# Altium project wifi_can.PrjPcb
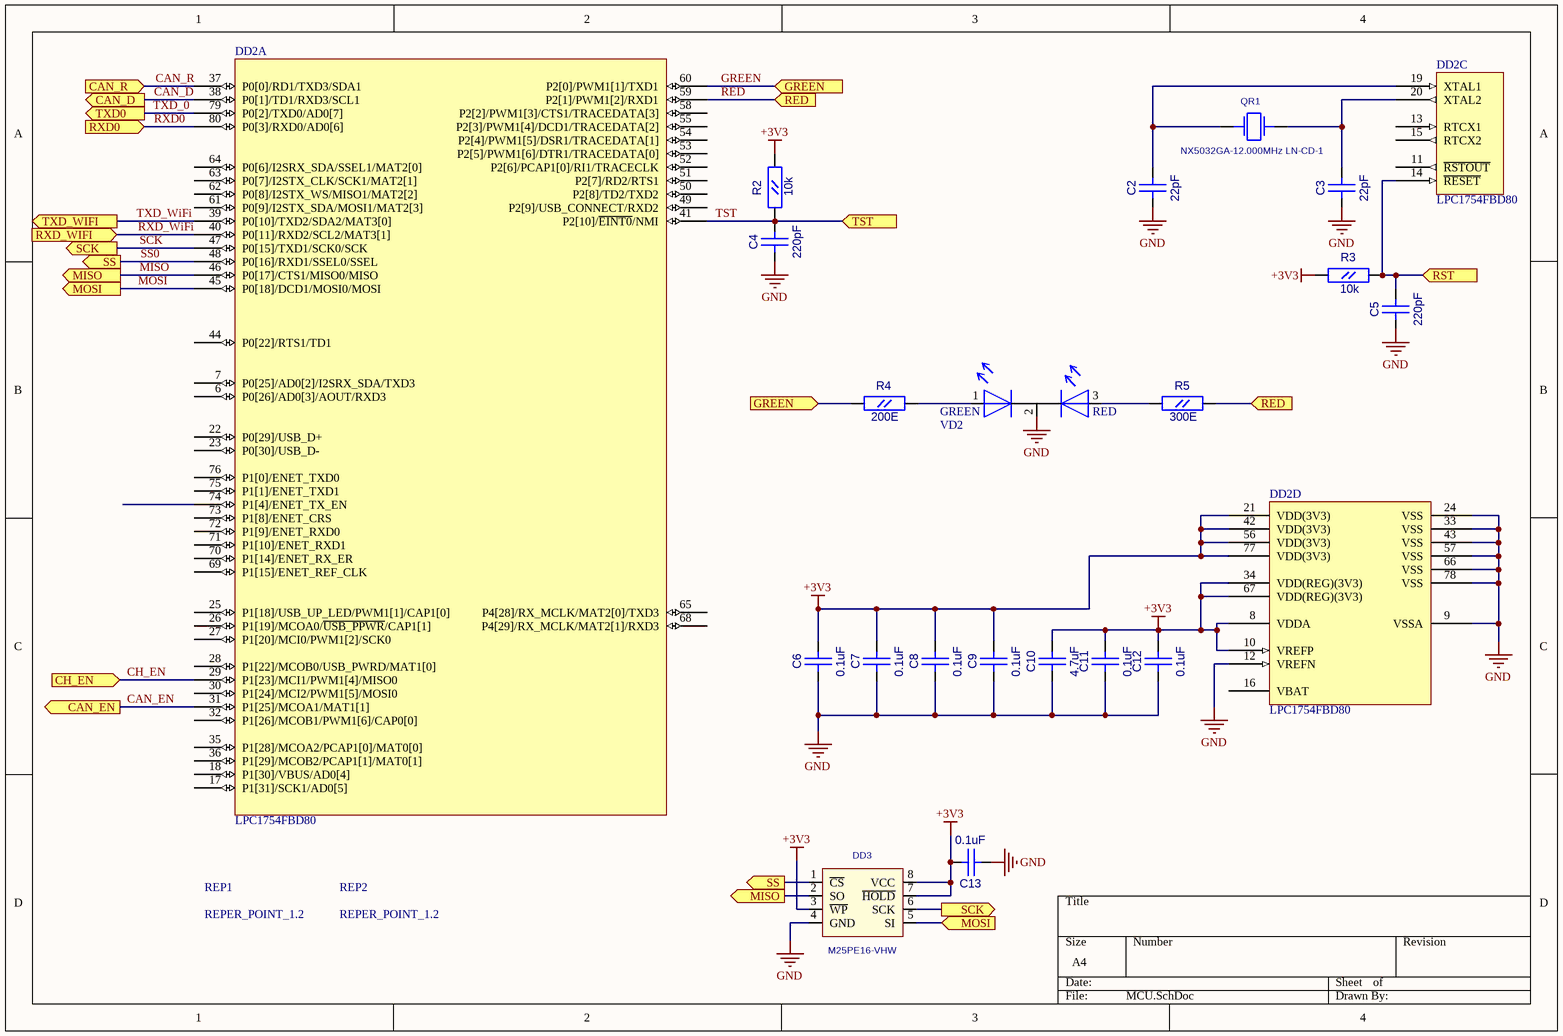
[diagram p0: MCU.SchDoc]
5 sheets, 64 parts. Net scope: flat (ports and power ports of the same name join across sheets).
Board file: wifi_can.PcbDoc
Sheets:
  MCU.SchDoc
  Power.SchDoc
  WiFi.SchDoc
  CAN.SchDoc
  Connections.SchDoc

## Sheet MCU.SchDoc
size A4

### Parts
C2  22pF  [CC0603]
C3  22pF  [CC0603]
C4  220pF  [CC0603]
C5  220pF  [CC0603]
C6  0.1uF  [CC0603]
C7  0.1uF  [CC0603]
C8  0.1uF  [CC0603]
C9  0.1uF  [CC0603]
C10  4.7uF  [CC0805]
C11  0.1uF  [CC0603]
C12  0.1uF  [CC0603]
C13  0.1uF  [CC0603]
DD2  LPC1754FBD80  [TQFP-80_0.5]  (parts A,C,D of 4)
DD3  M25PE16-VHW  [EIAJ_SO8]
QR1  NX5032GA-12.000MHz LN-CD-1  [AC5032_2]
R2  10k  [RC0603]
R3  10k  [RC0603]
R4  200E  [RC0603]
R5  300E  [RC0603]
REP1  REPER_POINT_1.2  [REPER1.2]
REP2  REPER_POINT_1.2  [REPER1.2]
VD2  GNL3015UEUGW  [GNL3015]  (value not drawn)

### Ports
CAN_D (out), CAN_EN (out), CAN_R (in), CH_EN (in), GREEN (in), MISO (out), MOSI (in), MOSI (out), RED (in), RST (in), RXD0 (in), RXD_WIFI (in), SCK (out), SS (out), TST (in), TXD0 (out), TXD_WIFI (out)

### Nets
+3V3: C6.2(B) C7.2(B) C8.2(B) C9.2(B) C10.2(B) C11.2(B) C12.2(B) C13.2(B) DD2.8(VDDA) DD2.10(VREFP) DD2.21(VDD(3V3)) DD2.34(VDD(REG)(3V3)) DD2.42(VDD(3V3)) DD2.56(VDD(3V3)) DD2.67(VDD(REG)(3V3)) DD2.77(VDD(3V3)) DD3.3(~{WP}) DD3.7(~{HOLD}) DD3.8(VCC) R2.2(B) R3.1(A)
GND: C2.1(A) C3.1(A) C4.1(A) C5.1(A) C6.1(A) C7.1(A) C8.1(A) C9.1(A) C10.1(A) C11.1(A) C12.1(A) C13.1(A) DD2.9(VSSA) DD2.12(VREFN) DD2.24(VSS) DD2.33(VSS) DD2.43(VSS) DD2.57(VSS) DD2.66(VSS) DD2.78(VSS) DD3.4(GND) VD2.2
CAN_D: DD2.38(P0[1]/TD1/RXD3/SCL1) ; port CAN_D
CAN_EN: DD2.31(P1[25]/MCOA1/MAT1[1]) ; port CAN_EN
CAN_R: DD2.37(P0[0]/RD1/TXD3/SDA1) ; port CAN_R
CH_EN: DD2.29(P1[23]/MCI1/PWM1[4]/MISO0) ; port CH_EN
GREEN: DD2.60(P2[0]/PWM1[1]/TXD1) R4.1(A) ; port GREEN
MISO: DD2.46(P0[17]/CTS1/MISO0/MISO) DD3.2(SO) ; port MISO
MOSI: DD2.45(P0[18]/DCD1/MOSI0/MOSI) DD3.5(SI) ; port MOSI
RED: DD2.59(P2[1]/PWM1[2]/RXD1) R5.2(B) ; port RED
RXD0: DD2.80(P0[3]/RXD0/AD0[6]) ; port RXD0
RXD_WiFi: DD2.40(P0[11]/RXD2/SCL2/MAT3[1]) ; port RXD_WIFI
SCK: DD2.47(P0[15]/TXD1/SCK0/SCK) DD3.6(SCK) ; port SCK
SS0: DD2.48(P0[16]/RXD1/SSEL0/SSEL) DD3.1(~{CS}) ; port SS
TST: C4.2(B) DD2.41(P2[10]/~{EINT0}/NMI) R2.1(A) ; port TST
TXD_0: DD2.79(P0[2]/TXD0/AD0[7]) ; port TXD0
TXD_WiFi: DD2.39(P0[10]/TXD2/SDA2/MAT3[0]) ; port TXD_WIFI
NetC2_2: C2.2(B) DD2.19(XTAL1) QR1.1
NetC3_2: C3.2(B) DD2.20(XTAL2) QR1.2
NetC5_2: C5.2(B) DD2.14(~{RESET}) R3.2(B) ; port RST
NetR4_2: R4.2(B) VD2.1(G)
NetR5_1: R5.1(A) VD2.3

Not connected (* = marked no-connect by the designer): DD2 6(P0[26]/AD0[3]/AOUT/RXD3) 7(P0[25]/AD0[2]/I2SRX_SDA/TXD3) 11(~{RSTOUT}) 13(RTCX1) 15(RTCX2) 16(VBAT) 17(P1[31]/SCK1/AD0[5]) 18(P1[30]/VBUS/AD0[4]) 22(P0[29]/USB_D+) 23(P0[30]/USB_D-) 25(P1[18]/USB_UP_LED/PWM1[1]/CAP1[0]) 26(P1[19]/MCOA0/~{USB_PPWR}/CAP1[1]) 27(P1[20]/MCI0/PWM1[2]/SCK0) 28(P1[22]/MCOB0/USB_PWRD/MAT1[0]) 30(P1[24]/MCI2/PWM1[5]/MOSI0) 32(P1[26]/MCOB1/PWM1[6]/CAP0[0]) 35(P1[28]/MCOA2/PCAP1[0]/MAT0[0]) 36(P1[29]/MCOB2/PCAP1[1]/MAT0[1]) 44(P0[22]/RTS1/TD1) 49(P2[9]/USB_CONNECT/RXD2) 50(P2[8]/TD2/TXD2) 51(P2[7]/RD2/RTS1) 52(P2[6]/PCAP1[0]/RI1/TRACECLK) 53(P2[5]/PWM1[6]/DTR1/TRACEDATA[0]) 54(P2[4]/PWM1[5]/DSR1/TRACEDATA[1]) 55(P2[3]/PWM1[4]/DCD1/TRACEDATA[2]) 58(P2[2]/PWM1[3]/CTS1/TRACEDATA[3]) 61(P0[9]/I2STX_SDA/MOSI1/MAT2[3]) 62(P0[8]/I2STX_WS/MISO1/MAT2[2]) 63(P0[7]/I2STX_CLK/SCK1/MAT2[1]) 64(P0[6]/I2SRX_SDA/SSEL1/MAT2[0]) 65(P4[28]/RX_MCLK/MAT2[0]/TXD3) 68(P4[29]/RX_MCLK/MAT2[1]/RXD3) 69(P1[15]/ENET_REF_CLK) 70(P1[14]/ENET_RX_ER) 71(P1[10]/ENET_RXD1) 72(P1[9]/ENET_RXD0) 73(P1[8]/ENET_CRS) 74(P1[4]/ENET_TX_EN) 75(P1[1]/ENET_TXD1) 76(P1[0]/ENET_TXD0); REP1 1; REP2 1

### Notes on the sheet
- (in symbol GNL3015-UEUGW) GREEN; RED

### Library data of the parts
C2-C9 C11-C13 = CC0603
  C2 C3: Value: 22pF
  C4 C5: Value: 220pF
  C6-C9 C11-C13: Value: 0.1uF
C10 = CC0805: Value: 4.7uF
DD2 = LPC1754FBD80: Cortex -M3 32-Bit Microcontroller, 128KB Flash, 64KB RAM, 800-Lead LQFP; ComponentLink1Description: Manufacturer Link; ComponentLink1URL: http://www.nxp.com/
DD3 = S25FL016A0LMFI01: Value: M25PE16-VHW
QR1 = AC5032_2: AC5032/2; Value: NX5032GA-12.000MHz LN-CD-1
R2-R5 = RC0603
  R2 R3: Value: 10k
  R4: Value: 200E
  R5: Value: 300E
REP1 REP2 = REPER1.2: Value: REPER_POINT_1.2
VD2 = GNL3015-UEUGW: Value: GNL3015UEUGW

## Sheet Power.SchDoc
size A4
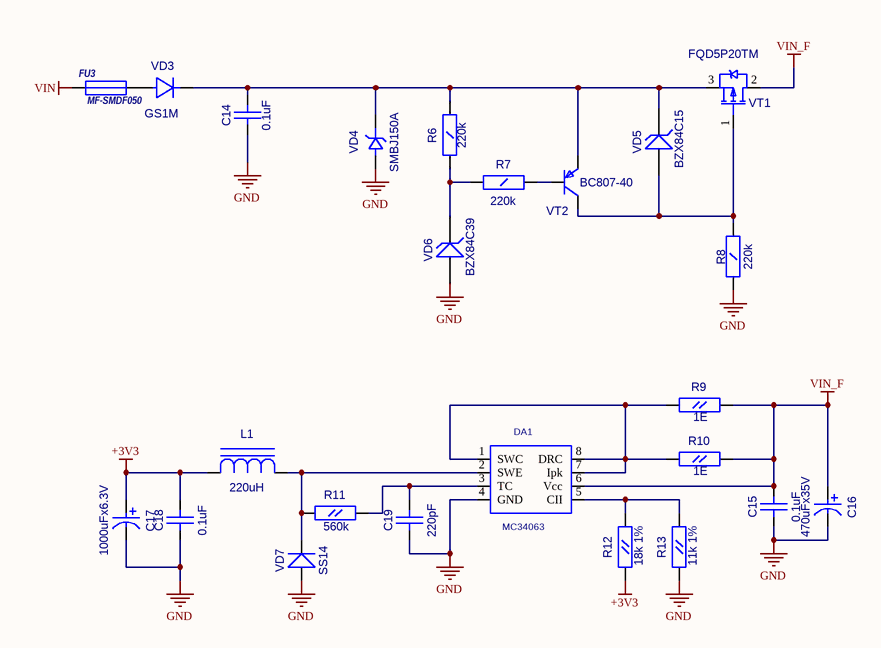
[diagram p1: Power.SchDoc]

### Parts
C14  0.1uF  [CC1206]
C15  0.1uF  [CC0603]
C16  470uFx35V  [CC16X10_CAP0.5(1)(Primary)]
C17  1000uFx6.3V  [CC8X3.5]
C18  0.1uF  [CC0603]
C19  220pF  [CC0603]
DA1  MC34063  [SO-8]
FU3  MF-SMDF050  [MF-SMDF]
L1  220uH  [SDR0805]
R6  220k  [RC1206]
R7  220k  [RC1206]
R8  220k  [RC1206]
R9  1E  [RC0805]
R10  1E  [RC0805]
R11  560k  [RC0603]
R12  18k 1%  [RC0603]
R13  11k 1%  [RC0603]
VD3  GS1M  [SMA]
VD4  SMBJ150A  [SMB]
VD5  BZX84C15  [SOT-23(123)]
VD6  BZX84C39  [SOT-23(123)]
VD7  SS14  [SMA]
VT1  FQD5P20TM  [D-PAK(TO-252AA)]
VT2  BC807-40  [SOT-23(123)]

### Nets
+3V3: C17.1 C18.2(B) L1.1(C) R12.1(A)
GND: C14.1(A) C15.1(A) C16.1 C17.2 C18.1(A) C19.1(A) DA1.4(GND) R8.2(B) R13.1(A) VD4.1(A) VD6.1(A) VD7.1(A)
VIN: FU3.1
VIN_F: C15.2(B) C16.2 DA1.6(Vcc) R9.2(B) R10.2(B) VT1.2(D)
NetC14_2: C14.2(B) R6.2(B) VD3.2(K) VD4.2(K) VD5.3(K) VT1.3(S) VT2.2(E)
NetC19_2: C19.2(B) DA1.3(TC) R11.2(B)
NetDA1_1: DA1.1(SWC) DA1.7(Ipk) DA1.8(DRC) R9.1(A) R10.1(A)
NetDA1_2: DA1.2(SWE) L1.2(A) R11.1(A) VD7.2(K)
NetDA1_5: DA1.5(CII) R12.2(B) R13.2(B)
NetFU3_2: FU3.2 VD3.1(A)
NetR6_1: R6.1(A) R7.1(A) VD6.3(K)
NetR7_2: R7.2(B) VT2.1(B)
NetR8_1: R8.1(A) VD5.1(A) VT1.1(G) VT2.3(C)

### Library data of the parts
C14 = CC1206: Value: 0.1uF
C15 C18 C19 = CC0603
  C15 C18: Value: 0.1uF
  C19: Value: 220pF
C16 = CAP0.5(1): Value: 470uFx35V
C17 = CAP0.35: Value: 1000uFx6.3V
FU3 = MF-SMDF: Value: MF-SMDF050
L1 = SDR0805: Value: 220uH
R6-R8 = RC1206: Value: 220k
R9 R10 = RC0805: Value: 1E
R11-R13 = RC0603
  R11: Value: 560k
  R12: Value: 18k 1%
  R13: Value: 11k 1%
VD3 = GS1M: Value: {Value}
VD4 = SMBJ: Value: SMBJ150A
VD5 VD6 = BZX84: Zener Voltage Regulator Diode; Value: {Value}
VD7 = SS14: Schottky Rectifier; OriginalName: 10BQ100; ComponentField6: Published 8-Jun-2000, Modified 10-July-2000: SIM Model Added.; Value: SS14
VT1 = IRFR9220: HEXFET Power MOSFET; OriginalName: IRLML5103; ComponentField7: Published 8-Jun-2000; Value: FQD5P20TM
VT2 = BC857B: OriginalName: BC846BLT1; ComponentField7: Published 29-Sep-2000; Value: BC807-40
DA1 = MC34063: Value: *

## Sheet WiFi.SchDoc
size A4
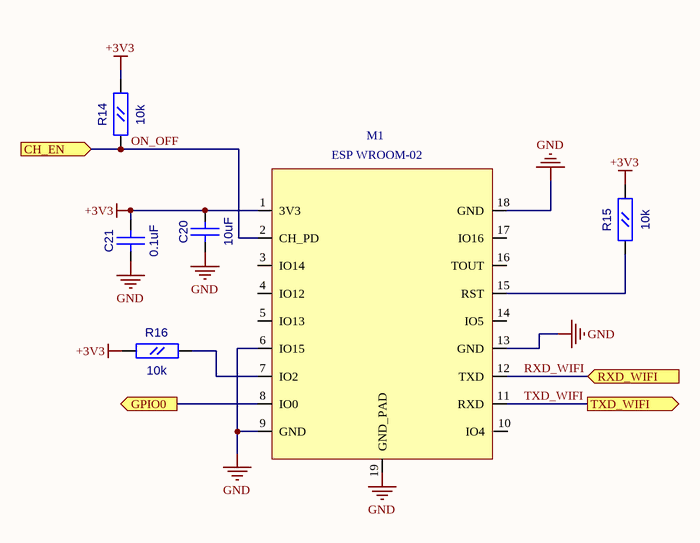
[diagram p2: WiFi.SchDoc]

### Parts
C20  10uF  [CC0805]
C21  0.1uF  [CC0603]
M1  ESP WROOM-02  [ESP-WOORM-02]
R14  10k  [RC0603]
R15  10k  [RC0603]
R16  10k  [RC0603]

### Ports
CH_EN (in), GPIO0 (out), RXD_WIFI (in), TXD_WIFI (out)

### Nets
+3V3: C20.2(B) C21.2(B) M1.1(3V3) R14.2(B) R15.2(B) R16.1(A)
GND: C20.1(A) C21.1(A) M1.6(IO15) M1.9(GND) M1.13(GND) M1.18(GND) M1.19(GND_PAD)
ON_OFF: M1.2(CH_PD) R14.1(A) ; port CH_EN  [project net CH_EN]
RXD_WiFi: M1.12(TXD) ; port RXD_WIFI
TXD_WiFi: M1.11(RXD) ; port TXD_WIFI
NetM1_7: M1.7(IO2) R16.2(B)
NetM1_8: M1.8(IO0) ; port GPIO0
NetM1_15: M1.15(RST) R15.1(A)

Not connected (* = marked no-connect by the designer): M1 3(IO14) 4(IO12) 5(IO13) 10(IO4) 14(IO5) 16(TOUT) 17(IO16)

### Library data of the parts
C20 = CC0805: Value: 10uF
C21 = CC0603: Value: 0.1uF
M1 = ESP-WROOM-02: Value: ESP WROOM-02
R14-R16 = RC0603: Value: 10k

## Sheet CAN.SchDoc
size A4
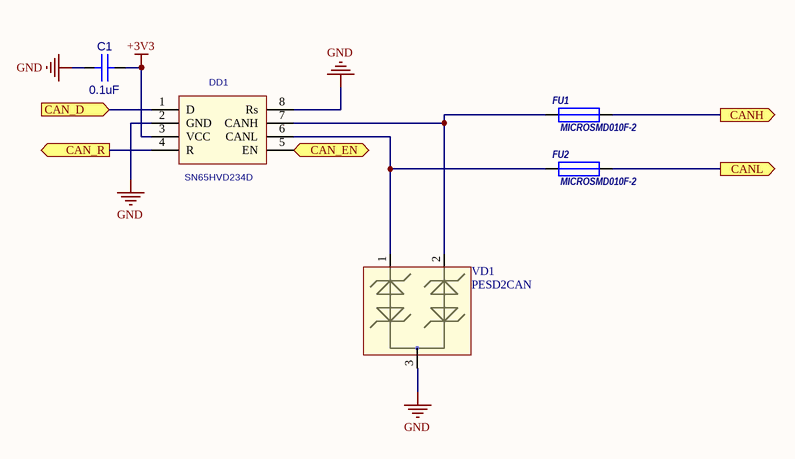
[diagram p3: CAN.SchDoc]

### Parts
C1  0.1uF  [CC0603]
DD1  SN65HVD234D  [SO-8]
FU1  MICROSMD010F-2  [RC1210]
FU2  MICROSMD010F-2  [RC1210]
VD1  PESD2CAN  [SOT-23(123)]

### Ports
CAN_D (in), CAN_EN (out), CAN_R (out), CANH (out), CANL (out)

### Nets
+3V3: C1.2(B) DD1.3(VCC)
GND: C1.1(A) DD1.2(GND) DD1.8(Rs) VD1.3
CAN_D: DD1.1(D) ; port CAN_D
CAN_EN: DD1.5(EN) ; port CAN_EN
CAN_R: DD1.4(R) ; port CAN_R
NetDD1_6: DD1.6(CANL) FU2.1 VD1.1
NetDD1_7: DD1.7(CANH) FU1.1 VD1.2
NetFU1_2: FU1.2 ; port CANH
NetFU2_2: FU2.2 ; port CANL

### Library data of the parts
C1 = CC0603: Value: 0.1uF
DD1 = SN65HVD234D: CAN Transceiver; Value: *
FU1 FU2 = MICROSMD: Value: MICROSMD010F-2
VD1 = PESD2CAN: TVS for CAN

## Sheet Connections.SchDoc
size A4
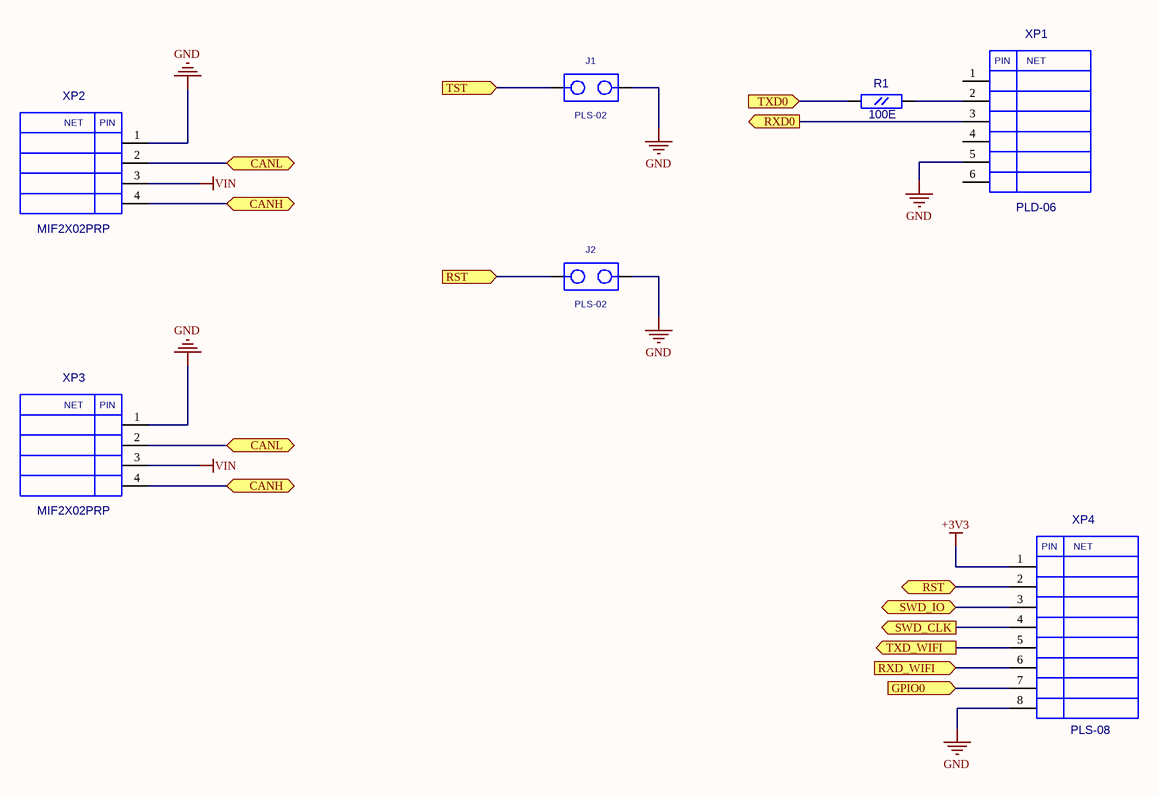
[diagram p4: Connections.SchDoc]

### Parts
J1  PLS-02  [PLS-02]
J2  PLS-02  [PLS-02]
R1  100E  [RC0603]
XP1  PLD-06  [PIN6]
XP2  MIF2X02PRP  [MIF2X02PRP]
XP3  MIF2X02PRP  [MIF2X02PRP]
XP4  PLS-08  [PLS-08]

### Ports
CANH (bidir), CANL (bidir), GPIO0 (in), RST (bidir), RST (in), RXD0 (out), RXD_WIFI (in), SWD_CLK (out), SWD_IO (bidir), TST (in), TXD0 (in), TXD_WIFI (out)

### Nets
+3V3: XP4.1
GND: J1.2 J2.2 XP1.5 XP2.1 XP3.1 XP4.8
VIN: XP2.3 XP3.3
RXD0: XP1.3 ; port RXD0
RXD_WiFi: XP4.6 ; port RXD_WIFI
TST: J1.1 ; port TST
TXD_0: R1.1(A) ; port TXD0
TXD_WiFi: XP4.5 ; port TXD_WIFI
NetC5_2: J2.1 XP4.2 ; port RST
NetFU1_2: XP2.4 XP3.4 ; port CANH
NetFU2_2: XP2.2 XP3.2 ; port CANL
NetM1_8: XP4.7 ; port GPIO0
NetR1_2: R1.2(B) XP1.2
NetXP4_3: XP4.3 ; port SWD_IO
NetXP4_4: XP4.4 ; port SWD_CLK

Not connected (* = marked no-connect by the designer): XP1 1 4 6

### Notes on the sheet
- (in symbol MIF2X02PRP) NET; PIN
- (in symbol PLS-08) PIN; NET

### Library data of the parts
R1 = RC0603: Value: 100E
XP1 = PLD-06: PLD06; Value: *
J1 J2 = PLS-02: Value: *
XP2 XP3 = MIF2X02PRP: Value: *
XP4 = PLS-08: Value: *

## Nets that join several sheets
+3V3: MCU (21 pins), Power (C17.1 C18.2 L1.1 R12.1), WiFi (6 pins), CAN (C1.2 DD1.3), Connections (XP4.1)
GND: MCU (22 pins), Power (12 pins), WiFi (7 pins), CAN (C1.1 DD1.2 DD1.8 VD1.3), Connections (6 pins)
VIN: Power (FU3.1), Connections (XP2.3 XP3.3)
CAN_D: MCU (DD2.38), CAN (DD1.1)
CAN_EN: MCU (DD2.31), CAN (DD1.5)
CAN_R: MCU (DD2.37), CAN (DD1.4)
CH_EN: MCU (DD2.29), WiFi (M1.2 R14.1)
NetC5_2: MCU (C5.2 DD2.14 R3.2), Connections (J2.1 XP4.2)
NetFU1_2: CAN (FU1.2), Connections (XP2.4 XP3.4)
NetFU2_2: CAN (FU2.2), Connections (XP2.2 XP3.2)
NetM1_8: WiFi (M1.8), Connections (XP4.7)
RXD0: MCU (DD2.80), Connections (XP1.3)
RXD_WiFi: MCU (DD2.40), WiFi (M1.12), Connections (XP4.6)
TST: MCU (C4.2 DD2.41 R2.1), Connections (J1.1)
TXD_0: MCU (DD2.79), Connections (R1.1)
TXD_WiFi: MCU (DD2.39), WiFi (M1.11), Connections (XP4.5)